# EAGLE schematic SparkFun_GPS_ZED-F9K_uHat (EAGLE 9.5.1)
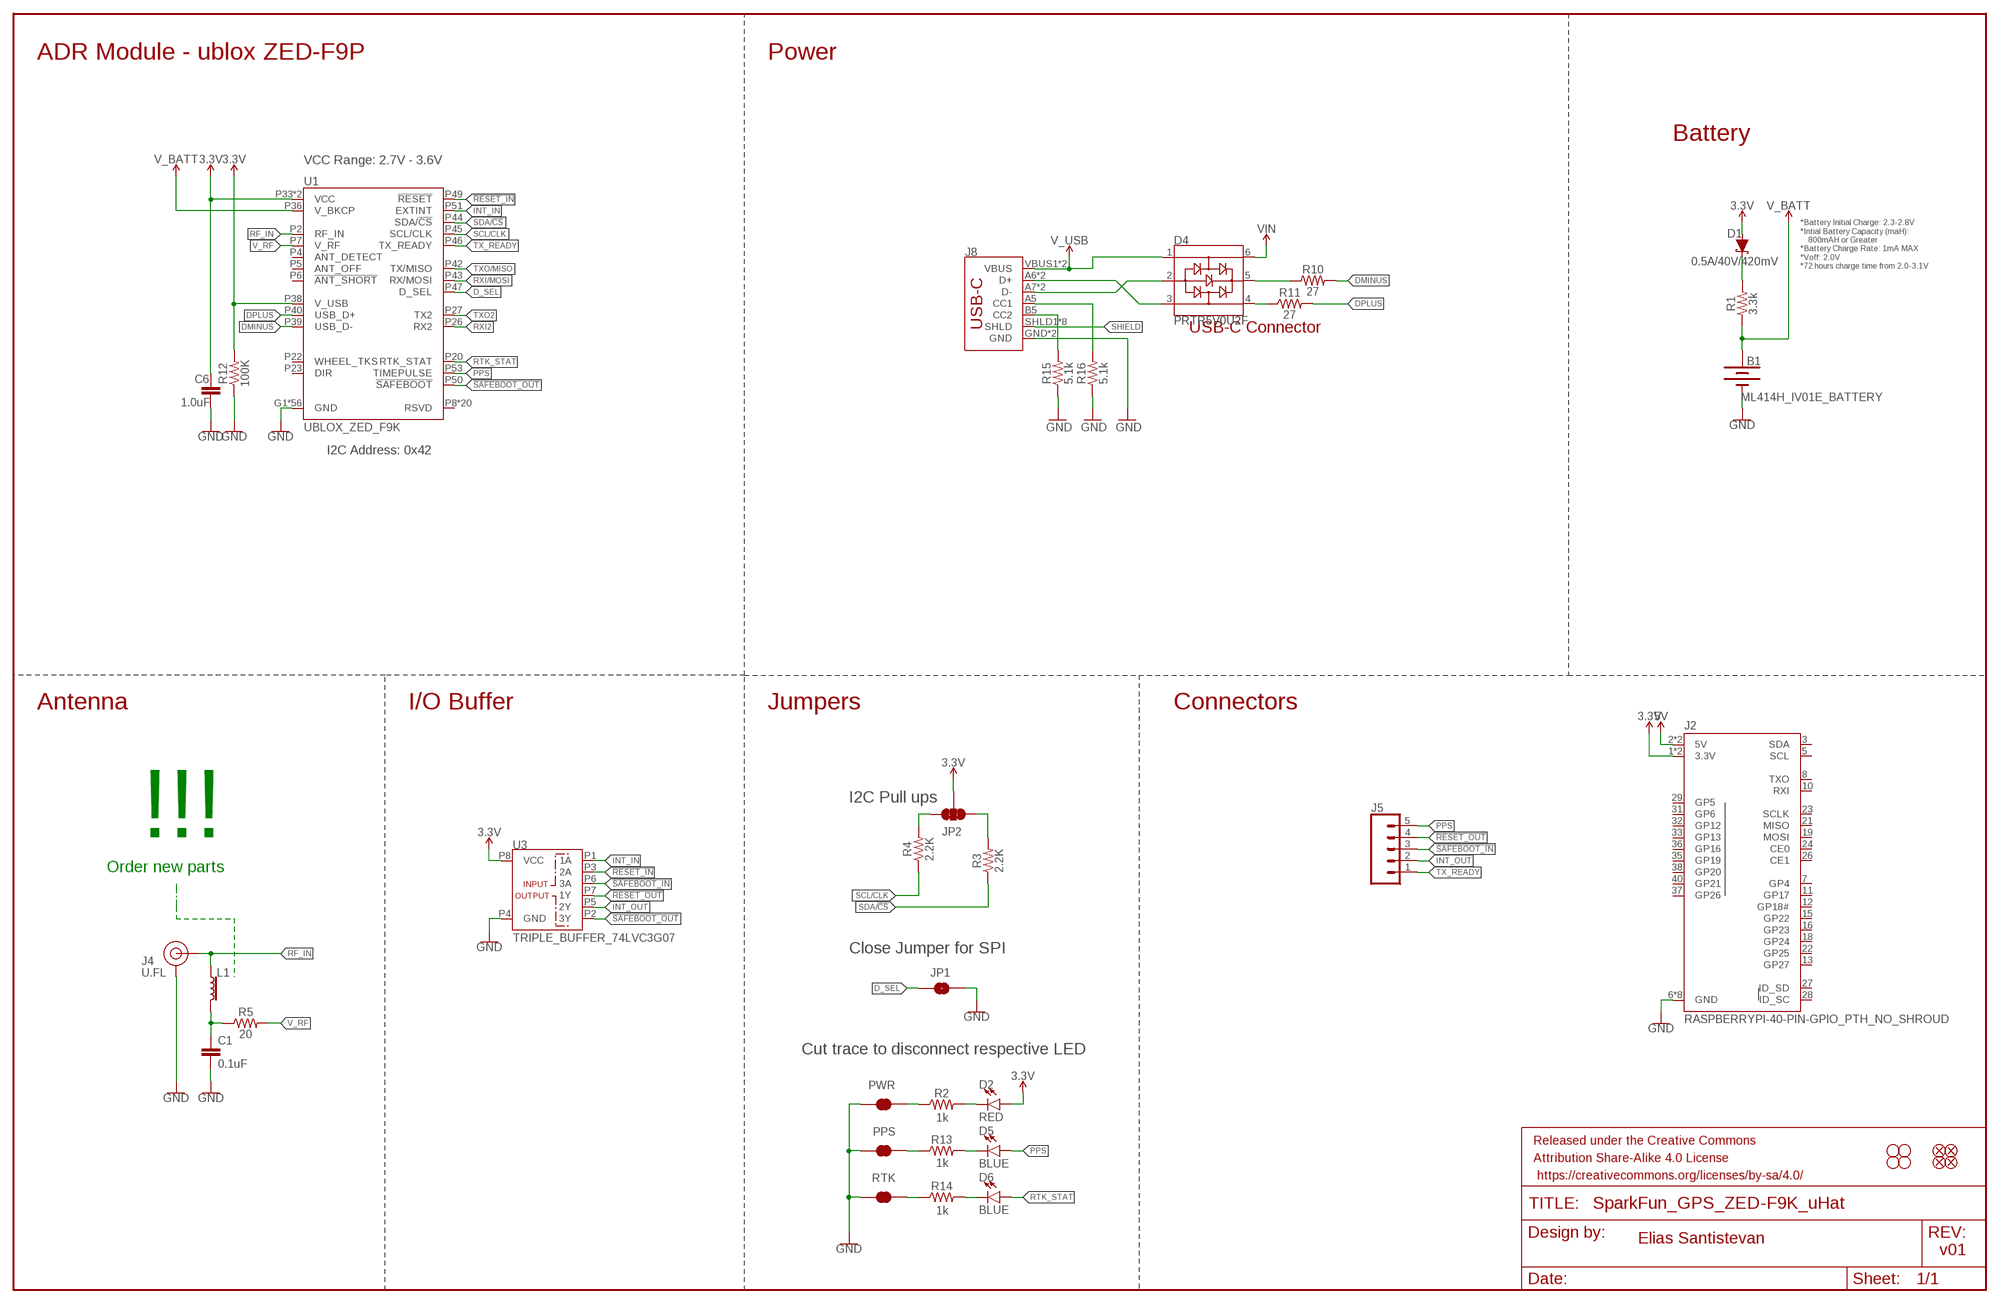
[diagram p0: schematic, sheet 1]

## Parts
B1  ML414H_IV01E_BATTERY  [ML414H_IV01E]
C1  0.1uF  0.1UF-0402-16V-10%  [0402]
C6  1.0uF  1.0UF-0402-16V-10%  [0402]
D1  0.5A/40V/420mV  DIODE-SCHOTTKY-PMEG4005EJ  [SOD-323]
D2  RED  LED-RED0603  [LED-0603]
D4  PRTR5V0U2F  [SOT886]
D5  BLUE  LED-BLUE0603  [LED-0603]
D6  BLUE  LED-BLUE0603  [LED-0603]
FD9  FIDUCIALUFIDUCIAL  [FIDUCIAL-MICRO]
FD10  FIDUCIALUFIDUCIAL  [FIDUCIAL-MICRO]
FD11  FIDUCIALUFIDUCIAL  [FIDUCIAL-MICRO]
FD12  FIDUCIALUFIDUCIAL  [FIDUCIAL-MICRO]
FRAME2  FRAME-LEDGER  [CREATIVE_COMMONS]
H9  STAND-OFFTIGHT  [STAND-OFF-TIGHT]
H10  STAND-OFFTIGHT  [STAND-OFF-TIGHT]
H11  STAND-OFFTIGHT  [STAND-OFF-TIGHT]
H12  STAND-OFFTIGHT  [STAND-OFF-TIGHT]
J2  RASPBERRYPI-40-PIN-GPIO_PTH_NO_SHROUD  [2X20]
J4  U.FL  U.FL2PIN  [U.FL]
J5  CONN_05NO_SILK  [1X05_NO_SILK]
J8  USB_C2-LAYER  [USB-C-16P]
JP1  JUMPER-SMT_2_NO_SILK  [SMT-JUMPER_2_NO_SILK]
JP2  JUMPER-SMT_3_2-NC_TRACE_SILK  [SMT-JUMPER_3_2-NC_TRACE_SILK]
L1  3.9NH  FERRITE_BEAD-120_OHM-0402  [0402]
PPS  JUMPER-SMT_2_NC_TRACE_SILK  [SMT-JUMPER_2_NC_TRACE_SILK]
PWR  JUMPER-SMT_2_NC_TRACE_SILK  [SMT-JUMPER_2_NC_TRACE_SILK]
R1  3.3k  3.3KOHM-0603-1/10W-1%  [0603]
R2  1KOHM-0402-1/16W-1%  [0402]
R3  2.2K  2.2KOHM-0402-1/16W-1%  [0402]
R4  2.2K  2.2KOHM-0402-1/16W-1%  [0402]
R5  20  20OHM-0603-1/10W-1%  [0603]
R10  27  27OHM-0603-1/10W-1%  [0603]
R11  27  27OHM-0603-1/10W-1%  [0603]
R12  100K  100KOHM-0402-1/16W-1%  [0402]
R13  1KOHM-0402-1/16W-1%  [0402]
R14  1KOHM-0402-1/16W-1%  [0402]
R15  5.1k  5.1KOHM-0402-1/16W-1%  [0402]
R16  5.1k  5.1KOHM-0402-1/16W-1%  [0402]
RTK  JUMPER-SMT_2_NC_TRACE_SILK  [SMT-JUMPER_2_NC_TRACE_SILK]
U1  UBLOX_ZED_F9K  [UBLOX_ZED_F9K]
U3  TRIPLE_BUFFER_74LVC3G07  [SOP_8-PIN]

## Nets
3.3V: C6.1 D1.A D2.A J2.1(3.3V) J2.17(3.3V) JP2.2 R12.2 U1.P33(VCC) U1.P34(VCC) U1.P38(V_USB) U3.P8(VCC)
5V: J2.2(5V) J2.4(5V)
!RESET_IN: U1.P49(!RESET!) U3.P3(2A)
!RESET_OUT: J5.4 U3.P7(1Y)
!SAFEBOOT_IN: J5.3 U3.P6(3A)
!SAFEBOOT_OUT: U1.P50(!SAFEBOOT!) U3.P2(3Y)
D_SEL: JP1.1 U1.P47(D_SEL)
DMINUS: R10.2 U1.P39(USB_D-)
DPLUS: R11.2 U1.P40(USB_D+)
GND: B1.- C1.2 C6.2 J2.6(GND) J2.9(GND) J2.14(GND) J2.20(GND) J2.25(GND) J2.30(GND) J2.34(GND) J2.39(GND) J4.1(GND) J4.2(GND) J8.GND J8.GND2(GND) JP1.2 PPS.1 PWR.1 R12.1 R15.1 R16.1 RTK.1 U1.G1(GND) U1.G2(GND) U1.G3(GND) U1.G4(GND) U1.G5(GND) U1.G6(GND) U1.G7(GND) U1.G8(GND) U1.G9(GND) U1.G10(GND) U1.G11(GND) U1.G12(GND) U1.G13(GND) U1.G14(GND) U1.G15(GND) U1.G16(GND) U1.G17(GND) U1.G18(GND) U1.G19(GND) U1.G20(GND) U1.G21(GND) U1.G22(GND) U1.G23(GND) U1.G24(GND) U1.G25(GND) U1.G26(GND) U1.G27(GND) U1.G28(GND) U1.G29(GND) U1.G30(GND) U1.G31(GND) U1.G32(GND) U1.G33(GND) U1.G34(GND) U1.G35(GND) U1.G36(GND) U1.G37(GND) U1.G38(GND) U1.G39(GND) U1.G40(GND) U1.G41(GND) U1.G42(GND) U1.G43(GND) U1.G44(GND) U1.G45(GND) U1.G46(GND) U1.G47(GND) U1.G48(GND) U1.P1(GND) U1.P3(GND) U1.P12(GND) U1.P14(GND) U1.P32(GND) U1.P37(GND) U1.P41(GND) U1.P48(GND) U3.P4(GND)
INT_IN: U1.P51(EXTINT) U3.P1(1A)
INT_OUT: J5.2 U3.P5(2Y)
N$1: JP2.1 R3.2
N$2: D1.C R1.2
N$3: JP2.3 R4.2
N$4: D2.C R2.2
N$5: C1.1 L1.2 R5.1
N$8: PWR.2 R2.1
N$12: J8.B5(CC2) R15.2
N$16: D4.5 R10.1
N$17: D4.4 R11.1
N$18: J8.A5(CC1) R16.2
N$22: R14.1 RTK.2
N$23: PPS.2 R13.1
N$24: D5.C R13.2
N$25: D6.C R14.2
PPS: D5.A J5.5 U1.P53(TIMEPULSE)
RF_IN: J4.FEED(SIGNAL) L1.1 U1.P2(RF_IN)
RTK_STAT: D6.A U1.P20(RTK_STAT)
RXI2: U1.P26(RX2)
RXI/MOSI: U1.P43(RX/MOSI)
SCL/CLK: R4.1 U1.P45(SCL/CLK)
SDA/!CS: R3.1 U1.P44(SDA/!CS!)
SHIELD: J8.SHLD1(SHLD) J8.SHLD2(SHLD) J8.SHLD3(SHLD) J8.SHLD4(SHLD) J8.SHLD5(SHLD) J8.SHLD6(SHLD) J8.SHLD7(SHLD) J8.SHLD8(SHLD)
TX_READY: J5.1 U1.P46(TX_READY)
TXO2: U1.P27(TX2)
TXO/MISO: U1.P42(TX/MISO)
USB_D+: D4.3 J8.A6(D+) J8.B6(D+)
USB_D-: D4.2 J8.A7(D-) J8.B7(D-)
V_BATT: B1.+ R1.1 U1.P36(V_BKCP)
V_RF: R5.2 U1.P7(V_RF)
V_USB: D4.1 J8.VBUS1(VBUS) J8.VBUS2(VBUS)
VIN: D4.6
Unconnected: J2.3(SDA) J2.5(SCL) J2.7(GP4) J2.8(TXO) J2.10(RXI) J2.11(GP17) J2.12(GP18#) J2.13(GP27) J2.15(GP22) J2.16(GP23) J2.18(GP24) J2.19(MOSI) J2.21(MISO) J2.22(GP25) J2.23(SCLK) J2.24(CE0) J2.26(CE1) J2.27(ID_SD) J2.28(ID_SC) J2.29(GP5) J2.31(GP6) J2.32(GP12) J2.33(GP13) J2.35(GP19) J2.36(GP16) J2.37(GP26) J2.38(GP20) J2.40(GP21) U1.P4(ANT_DETECT) U1.P5(ANT_OFF) U1.P6(!ANT_SHORT!) U1.P8(RSVD) U1.P9(RSVD) U1.P10(RSVD) U1.P11(RSVD) U1.P13(RSVD) U1.P15(RSVD) U1.P16(RSVD) U1.P17(RSVD) U1.P18(RSVD) U1.P19(RSVD) U1.P21(RSVD) U1.P22(WHEEL_TKS) U1.P23(DIR) U1.P24(RSVD) U1.P25(RSVD) U1.P28(RSVD) U1.P29(RSVD) U1.P30(RSVD) U1.P31(RSVD) U1.P35(RSVD) U1.P52(RSVD) U1.P54(RSVD)

## Notes on the sheet
- ADR Module - ublox ZED-F9P | Power
- Battery
- VCC Range: 2.7V - 3.6V
- *Battery Initial Charge: 2.3-2.8V
  *Intial Battery Capacity (maH): 
      800mAH or Greater
  *Battery Charge Rate: 1mA MAX
  *Voff: 2.0V
  *72 hours charge time from 2.0-3.1V
- USB-C Connector
- I2C Address: 0x42
- Antenna | I/O Buffer | Jumpers | Connectors
- I2C Pull ups
- !!!
- Order new parts
- Close Jumper for SPI
- Cut trace to disconnect respective LED
- 1k
- 1k
- 1k
- Elias Santistevan
- v01

## Library data of the parts
B1 = SparkFun-Batteries:ML414H_IV01E_BATTERY: SEIKO ML414H-IV01E Reflowable Lithium Battery ML414H is a rechargeable, coin type battery with features such as Pb-free reflowable (Peak temperature: 260 C) and high temperature heat resistance. Battery Characteristics: 3.1V max voltage Voff is 2V 1mAH 3k series resistor with battery 72 hour charge time from 2.0-3.1V 2.3-2.8V initial charge; PROD_ID: BATT-14267
C1 = SparkFun-Capacitors:0.1UF: 0.1µF ceramic capacitors A capacitor is a passive two-terminal electrical component used to store electrical energy temporarily in an electric field.; PROD_ID: CAP-12416
C6 = SparkFun-Capacitors:1.0UF: 1µF ceramic capacitors A capacitor is a passive two-terminal electrical component used to store electrical energy temporarily in an electric field.; PROD_ID: CAP-12417
D1 = SparkFun-DiscreteSemi:DIODE-SCHOTTKY: Schottky diode A Schottky diode is a semiconductor diode which has a low forward voltage drop and a very fast switching action.; PROD_ID: DIO-10955
D2 = SparkFun-LED:LED-RED: Red SMD LED Used in manufacturing of most products at SparkFun Packages: 0603 - SMD 0603 package [Product Link] <http://docs.avagotech.com/docs/AV02-0551EN> 0603 SMART - SMD 0603 SMART package ( more efficient and expensive)[Product Link] <http://www.osram-os.com/Graphics/XPic2/00077099_0.pdf> 1206 - SMD1206 package [Product Link] <https://www.sparkfun.com/datasheets/DevTools/LilyPad/Q150OVS4.pdff> SparkFun Products: Pro Mini 328 -5V <https://www.sparkfun.com/products/821> RedBoard <https://www.sparkfun.com/products/12757> IOIO-OTG <https://www.sparkfun.com/products/13613>; PROD_ID: DIO-00819
D4 = SparkFun-IC-Power:PRTR5V0U2: A small ESD protection device. Most commonly used on USB D+/D- signals to protect large, expensive, or especially sensitive USB enabled devices.; PROD_ID: DIO-14084
D5 D6 = SparkFun-LED:LED-BLUE: Blue SMD LED Used in manufacturing of various products at SparkFun Packages: 0603 - SMD 0603 package [Product Link] <http://www.digikey.com/product-detail/en/SMLE12BC7TT86/511-1589-2-ND/1641808> 1206 - SMD1206 package [Product Link] <http://www.digikey.com/product-detail/en/lite-on-inc/LTST-C150TBKT/160-1643-1-ND/573584> SparkFun Products: ESP8266 Thing-Dev Board <https://www.sparkfun.com/products/13711> RedBoard <https://www.sparkfun.com/products/12757>; PROD_ID: DIO-08575
FD9-FD12 = SparkFun-Aesthetics:FIDUCIAL: Fiducial Alignment Points Point-of-reference for pick-and-place machines and other optical instruments.
FRAME2 = SparkFun-Aesthetics:FRAME-LEDGER: Schematic Frame - Ledger Standard 11x14 US Ledger frame
H9-H12 = SparkFun-Hardware:STAND-OFF: Stand Off Drill holes for mechanically mounting via screws, standoffs, etc. Note: Use the keepout ring to avoid running the screw head into surrounding components. Variant Overviews STAND-OFF - Mechanical footprint for a #4 phillips button head screw. STAND-OFF-TIGHT - Mechanical footprint for a #4 phillips button head screw, Example SparkFun Products Screw - Phillips Head (1/4", 4-40, 10 pack) <https://www.sparkfun.com/products/10453> (PRT-10453) Screw - Phillips Head (1/2", 4-40, 10 pack) <https://www.sparkfun.com/products/10452> (PRT-10452) Screw - Phillips Head (3/4", 4-40, 10 pack) <https://www.sparkfun.com/products/10451> (PRT-10451) Screw - Phillips Head (1", 4-40, 10 pack) <https://www.sparkfun.com/products/10450> (PRT-10450)
J2 = SparkFun-Connectors:RASPBERRYPI-40-PIN-GPIO: Raspberry Pi GPIO Header 2x20 pin connector, as found on B, B+, A+ models. Both shrouded PTH and SMT versions available. SparkFun Products: GPIO Shrouded Header <https://www.sparkfun.com/products/13054>- PTH SparkFun Pi Wedge (Preassembled) <https://www.sparkfun.com/products/13717>
J4 = SparkFun-Connectors:U.FL2PIN: SMD Antenna Connector - U.FL 2mm height, 3.0mm x 3.0mm receptacle size. SparkFun Products: SparkFun WiFi Shield - ESP8266 <https://www.sparkfun.com/products/13287> SparkFun ESP8266 Thing <https://www.sparkfun.com/products/13231> SparkFun MiniGen - Pro Mini Signal Generator Shield <https://www.sparkfun.com/products/11420>; PROD_ID: CONN-09193; SF_ID: WRL-09144
J5 = SparkFun-Connectors:CONN_05: Multi connection point. Often used as Generic Header-pin footprint for 0.1 inch spaced/style header connections On any of the 0.1 inch spaced packages, you can populate with these: Break Away Headers - Straight <https://www.sparkfun.com/products/116> (PRT-00116) Break Away Male Headers - Right Angle <https://www.sparkfun.com/products/553> (PRT-00553) Female Headers <https://www.sparkfun.com/products/115> (PRT-00115) Break Away Headers - Machine Pin <https://www.sparkfun.com/products/117> (PRT-00117) Break Away Female Headers - Swiss Machine Pin <https://www.sparkfun.com/products/743> (PRT-00743) For SCREWTERMINALS and SPRING TERMINALS visit here: Screw Terimnals on SparkFun.com <https://www.sparkfun.com/search/results?term=Screw+Terminals> (5mm/3.5mm/2.54mm spacing) This device is also useful as a general connection point to wire up your design to another part of your project. Our various solder wires solder well into these plated through hole pads. Hook-Up Wire - Assortment (Stranded, 22 AWG) <https://www.sparkfun.com/products/11375> (PRT-11375) Hook-Up Wire - Assortment (Solid Core, 22 AWG) <https://www.sparkfun.com/products/11367> (PRT-11367) View the entire wire category on our website here <https://www.sparkfun.com/categories/141> Special notes: Molex polarized connector foot print use with SKU : PRT-08231 with associated crimp pins and housings. 1MM SMD Version SKU: PRT-10208
J8 = SparkFun-Connectors:USB_C: USB Type C 16Pin Connector Super Speed pins not available on the 16-pin purely SMD connector so this part is best for USB 2.0 implementations. D1 and D2 are tied together enabling D+/- no matter which way the cable is plugged into the connector. The two channel configuration pins (CC1/2) are exposed. These are normally connected to ground via 5.1k resistors but can be reconfigured for high current/high power applications.; PROD_ID: CONN-14122
JP1 = SparkFun-Jumpers:JUMPER-SMT_2_NO: Normally open jumper This jumper has two pads in close proximity to each other. Apply solder to close the connection. Round pads are easier to solder for beginners, but are a lot larger. SparkFun Product that uses the round pads: SparkFun EL Sequencer <https://www.sparkfun.com/products/12781>
JP2 = SparkFun-Jumpers:JUMPER-SMT_3_2-NC_TRACE: Normally closed trace jumper (2 of 2 connections) This jumper has a trace between all three pads so they are normally closed (NC). Use a razor knife to open the connection(s). For best results follow the IPC guidelines for cutting traces: Cutout at least 0.063 mm (0.005 in). Remove all loose material to clean up the cut area. Seal the cut with an approved epoxy. Reapply solder to reclose the connection(s).
L1 = SparkFun-Coils:FERRITE_BEAD-120_OHM: Ferrite Bead (blocks, cores, rings, chokes, etc.) Inductor with layers of ferrite used to suppress high frequencies. Often used to isolate high frequency noise.; MFG_PART: BLM15HB121SN1D; PROD_ID: NDUC-14206
PPS PWR RTK = SparkFun-Jumpers:JUMPER-SMT_2_NC_TRACE: Normally closed trace jumper This jumper has a trace between two pads so it's normally closed (NC). Use a razor knife to open the connection. For best results follow the IPC guidelines for cutting traces: Cutout at least 0.063 mm (0.005 in). Remove all loose material to clean up the cut area. Seal the cut with an approved epoxy. Reapply solder to reclose the connection.
R1 = SparkFun-Resistors:3.3KOHM: 3.3kΩ resistor A resistor is a passive two-terminal electrical component that implements electrical resistance as a circuit element. Resistors act to reduce current flow, and, at the same time, act to lower voltage levels within circuits. - Wikipedia; PROD_ID: RES-07851
R2 R13 R14 = SparkFun-Resistors:1KOHM: 1kΩ resistor A resistor is a passive two-terminal electrical component that implements electrical resistance as a circuit element. Resistors act to reduce current flow, and, at the same time, act to lower voltage levels within circuits. - Wikipedia; PROD_ID: RES-14342
R3 R4 = SparkFun-Resistors:2.2KOHM: 2.2kΩ resistor A resistor is a passive two-terminal electrical component that implements electrical resistance as a circuit element. Resistors act to reduce current flow, and, at the same time, act to lower voltage levels within circuits. - Wikipedia; PROD_ID: RES-14341
R5 = SparkFun-Resistors:20OHM: RES-07862; PROD_ID: RES-07862
R10 R11 = SparkFun-Resistors:27OHM: 27Ω resistor A resistor is a passive two-terminal electrical component that implements electrical resistance as a circuit element. Resistors act to reduce current flow, and, at the same time, act to lower voltage levels within circuits. - Wikipedia; PROD_ID: RES-09334
R12 = SparkFun-Resistors:100KOHM: 100kΩ resistor A resistor is a passive two-terminal electrical component that implements electrical resistance as a circuit element. Resistors act to reduce current flow, and, at the same time, act to lower voltage levels within circuits. - Wikipedia; PROD_ID: RES-13495
R15 R16 = SparkFun-Resistors:5.1KOHM; PROD_ID: RES-14340
U1 = classified:UBLOX_ZED_F9K: u-blox ZED-F9K ADR GPS Unit with Real Time Kinematics (RTK) and internal IMU = Automotive Dead Reckoning; PROD_ID: IC-14677
U3 = classified:TRIPLE_BUFFER_74LVC3G07: Triple Buffer with Open Drain Output - 74LVC3G07 The 74LVC3G07 provides three non-inverting buffers. The output of the device is an open-drain and can be connected to other open-drain outputs to implement active-LOW wired-OR or active-HIGH wired-AND functions. Input can be driven from either 3.3 V or 5 V devices. This feature allows the use of this device in a mixed 3.3 V and 5 V environment. Schmitt trigger action at all inputs makes the circuit tolerant for slower input rise and fall time. This device is fully specified for partial power-down applications using IOFF. The IOFF circuitry disables the output, preventing the damaging backflow current through the device when it is powered down